# Altium schematic sheet top.SchDoc
size A; SheetNumber: 1; SheetTotal: 2
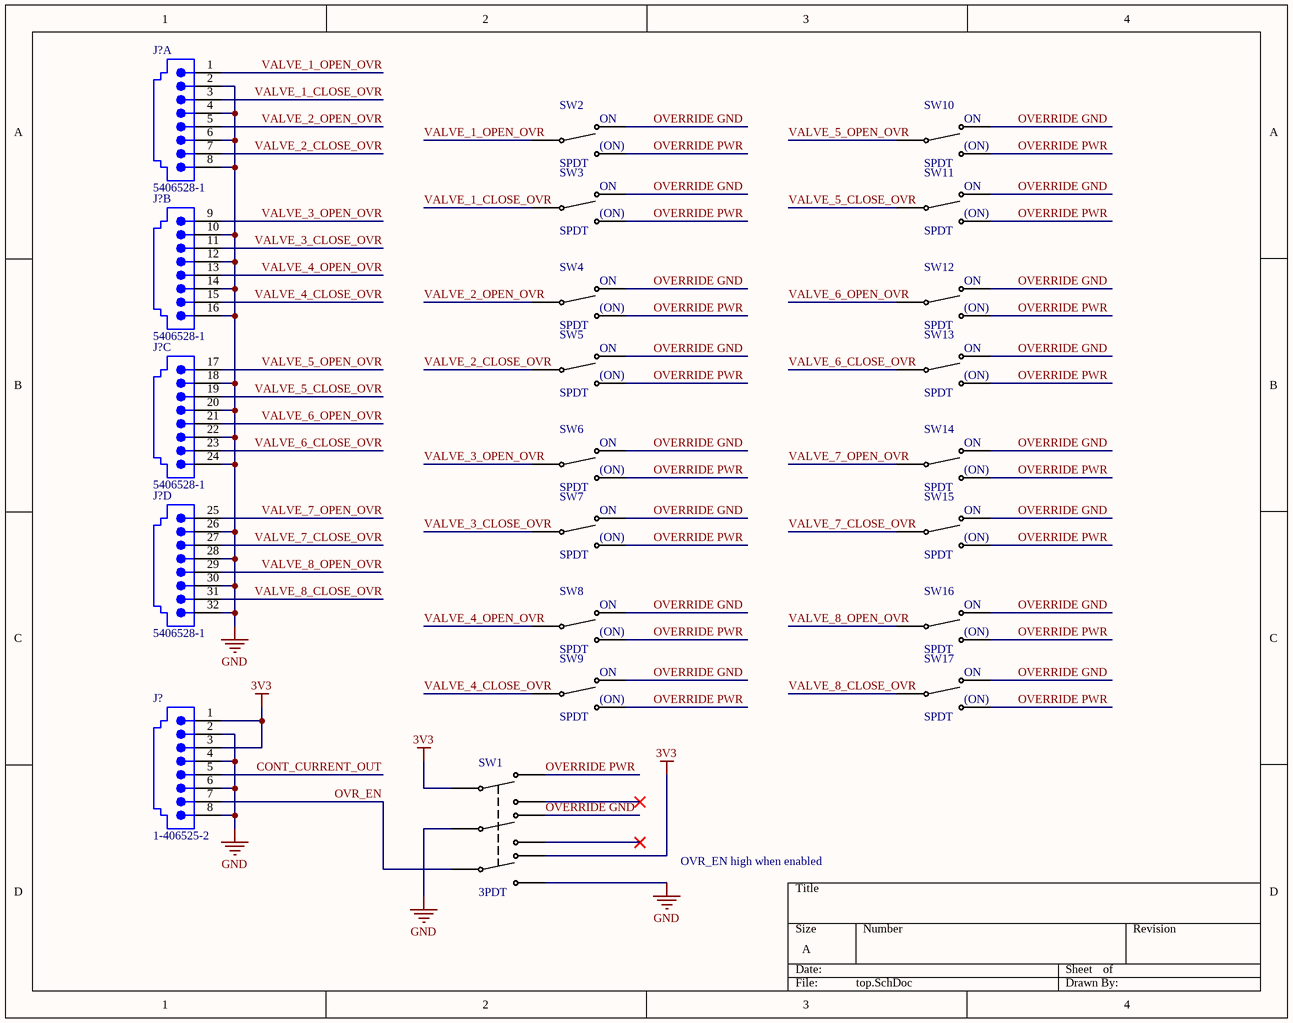
[diagram p0: top.SchDoc]

## Parts
(Parts that share a designator on the sheet are numbered #1, #2 ... from top to bottom, then left to right.)
J?#1  5406528-1  [5406528-1]  (part A of 4)
J?#2  5406528-1  [5406528-1]  (part B of 4)
J?#3  5406528-1  [5406528-1]  (part C of 4)
J?#4  5406528-1  [5406528-1]  (part D of 4)
J?#5  1-406525-2  [1-406525-2]
SW1  3PDT  [2368-54-323PC-ND]
SW2  SPDT  [2368-54-301PC-ND]
SW3  SPDT  [2368-54-301PC-ND]
SW4  SPDT  [2368-54-301PC-ND]
SW5  SPDT  [2368-54-301PC-ND]
SW6  SPDT  [2368-54-301PC-ND]
SW7  SPDT  [2368-54-301PC-ND]
SW8  SPDT  [2368-54-301PC-ND]
SW9  SPDT  [2368-54-301PC-ND]
SW10  SPDT  [2368-54-301PC-ND]
SW11  SPDT  [2368-54-301PC-ND]
SW12  SPDT  [2368-54-301PC-ND]
SW13  SPDT  [2368-54-301PC-ND]
SW14  SPDT  [2368-54-301PC-ND]
SW15  SPDT  [2368-54-301PC-ND]
SW16  SPDT  [2368-54-301PC-ND]
SW17  SPDT  [2368-54-301PC-ND]

## Nets
3V3: J?#5.1 J?#5.3 SW1.1 SW1.2
GND: J?#1.2 J?#1.4 J?#1.6 J?#1.8 J?#2.10 J?#2.12 J?#2.14 J?#2.16 J?#3.18 J?#3.20 J?#3.22 J?#3.24 J?#4.26 J?#4.28 J?#4.30 J?#4.32 J?#5.2 J?#5.4 J?#5.6 J?#5.8 SW1.1 SW1.2
CONT_CURRENT_OUT: J?#5.5
OVERRIDE GND: SW1.2 SW2.2 SW3.2 SW4.2 SW5.2 SW6.2 SW7.2 SW8.2 SW9.2 SW10.2 SW11.2 SW12.2 SW13.2 SW14.2 SW15.2 SW16.2 SW17.2
OVERRIDE PWR: SW1.2 SW2.2 SW3.2 SW4.2 SW5.2 SW6.2 SW7.2 SW8.2 SW9.2 SW10.2 SW11.2 SW12.2 SW13.2 SW14.2 SW15.2 SW16.2 SW17.2
OVR_EN: J?#5.7 SW1.1
VALVE_1_CLOSE_OVR: J?#1.3 SW3.1
VALVE_1_OPEN_OVR: J?#1.1 SW2.1
VALVE_2_CLOSE_OVR: J?#1.7 SW5.1
VALVE_2_OPEN_OVR: J?#1.5 SW4.1
VALVE_3_CLOSE_OVR: J?#2.11 SW7.1
VALVE_3_OPEN_OVR: J?#2.9 SW6.1
VALVE_4_CLOSE_OVR: J?#2.15 SW9.1
VALVE_4_OPEN_OVR: J?#2.13 SW8.1
VALVE_5_CLOSE_OVR: J?#3.19 SW11.1
VALVE_5_OPEN_OVR: J?#3.17 SW10.1
VALVE_6_CLOSE_OVR: J?#3.23 SW13.1
VALVE_6_OPEN_OVR: J?#3.21 SW12.1
VALVE_7_CLOSE_OVR: J?#4.27 SW15.1
VALVE_7_OPEN_OVR: J?#4.25 SW14.1
VALVE_8_CLOSE_OVR: J?#4.31 SW17.1
VALVE_8_OPEN_OVR: J?#4.29 SW16.1

## Notes on the sheet
- OVR_EN high when enabled
- (in symbol SPDT) ON; (ON)

## Library data of the parts
J?#1-J?#4 = 5406528-1: 4 port RJ45
J?#5 = 1-406525-2: 1 port RJ45
SW2-SW17 = SPDT: Momentary